# EAGLE design ledui (EAGLE 7.2.0)
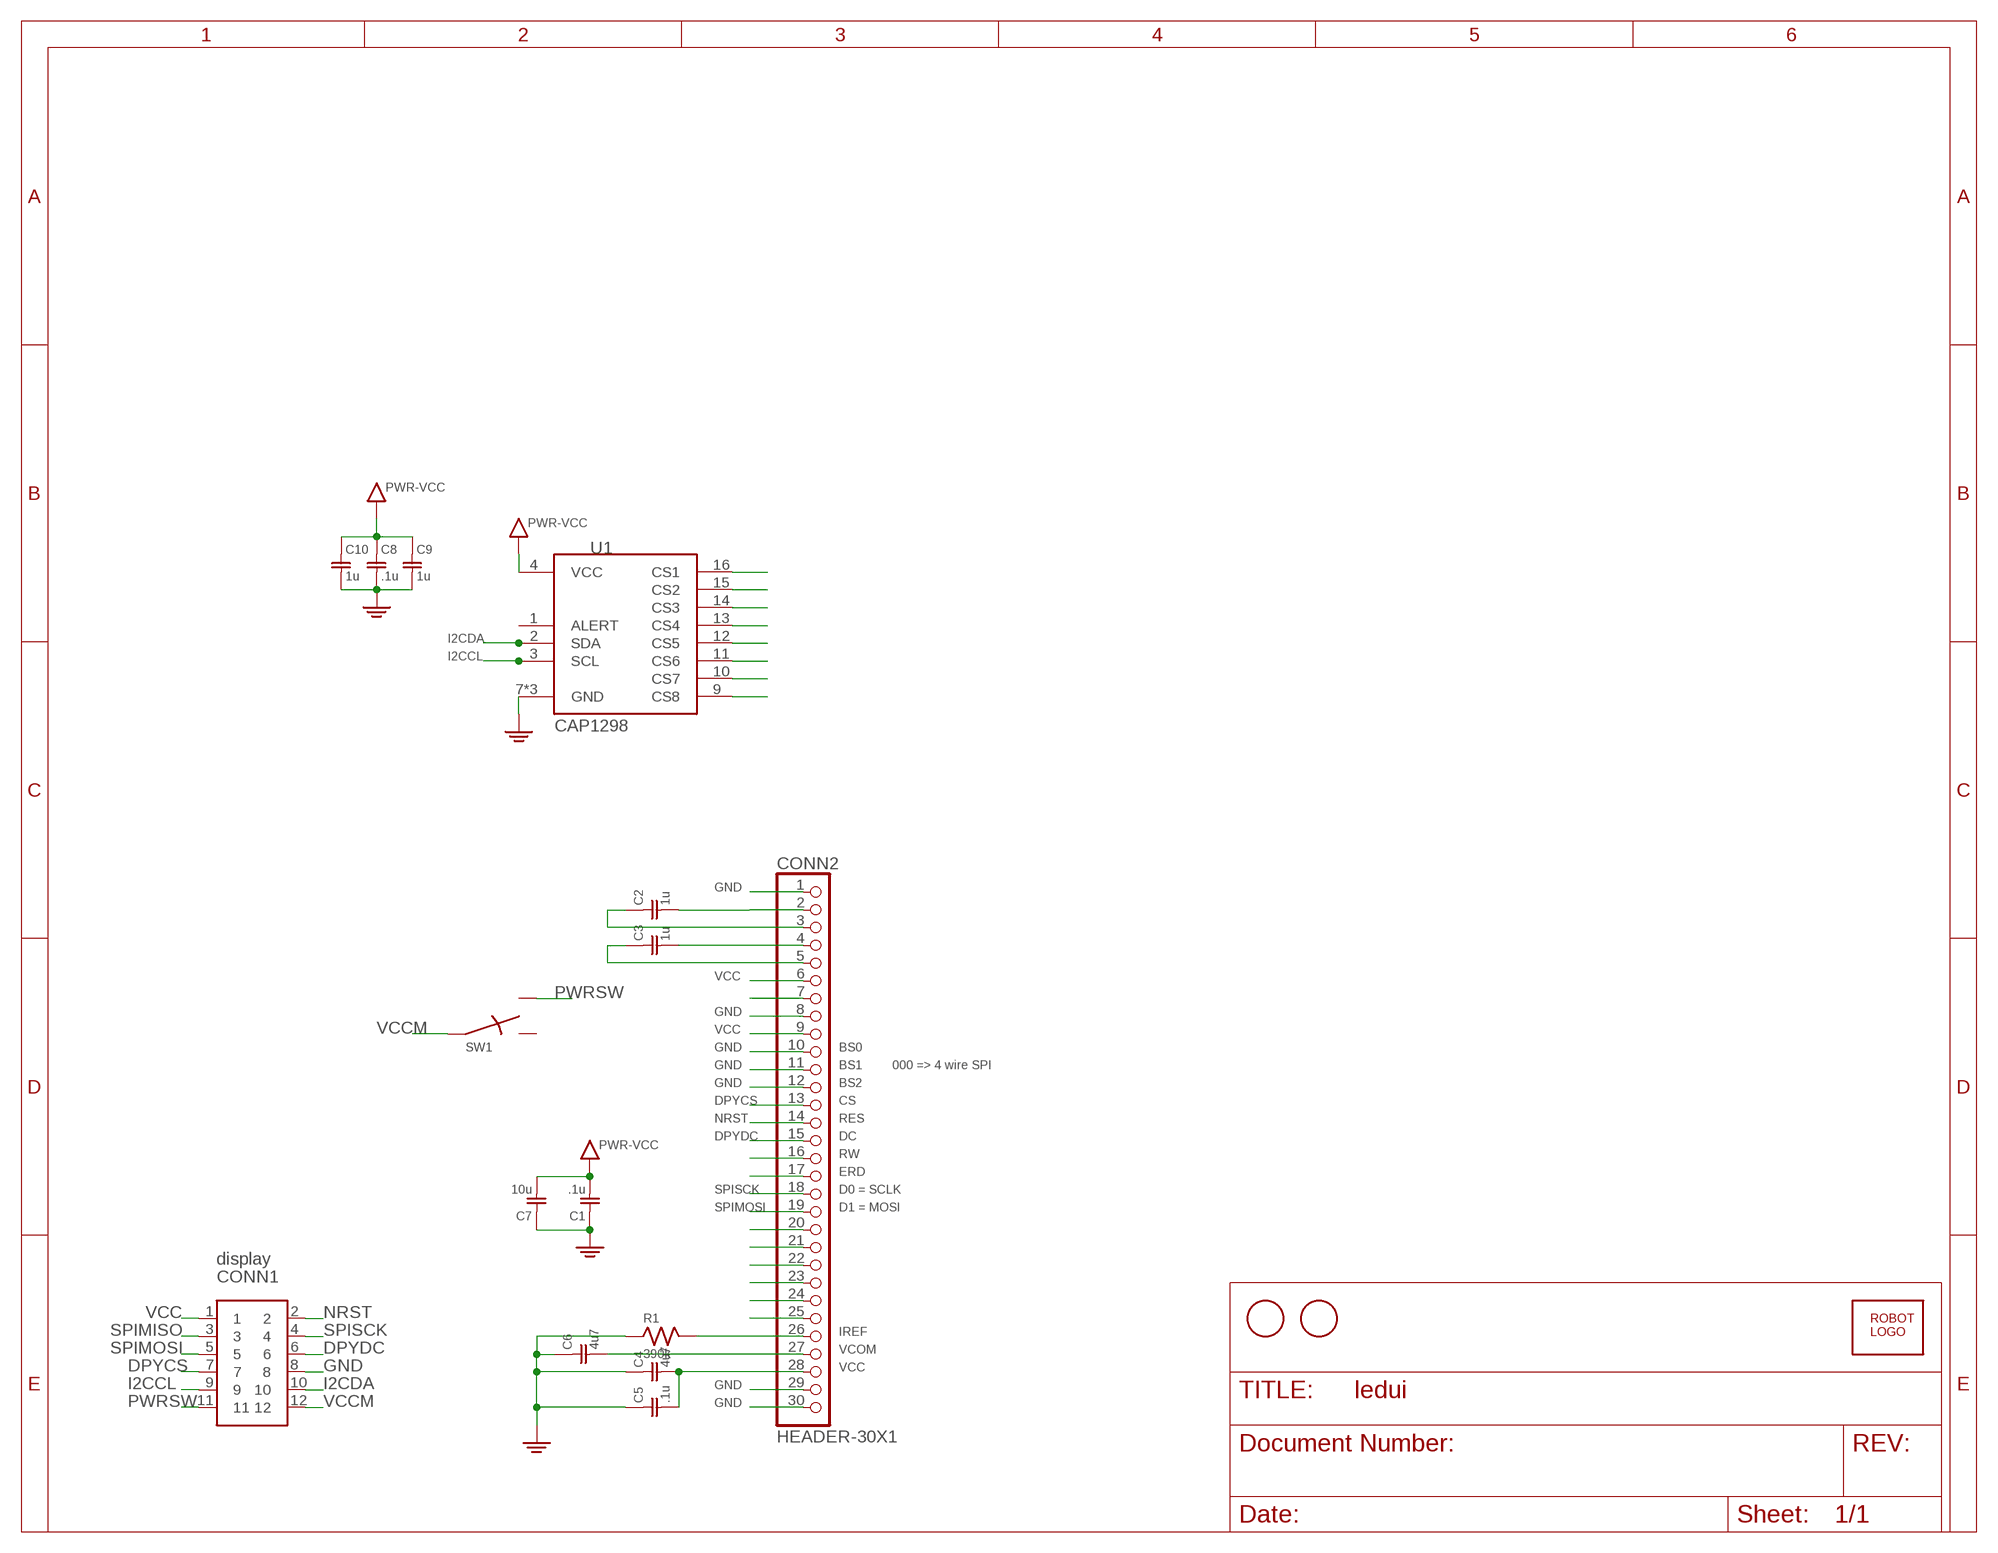
[diagram p0: schematic, sheet 1]

## Parts
C1  .1u  C0603  [SMD0603]
C2  1u  C0603  [SMD0603]
C3  1u  C0603  [SMD0603]
C4  4u7  C0603  [SMD0603]
C5  .1u  C0603  [SMD0603]
C6  4u7  C0603  [SMD0603]
C7  10u  C0603  [SMD0603]
C8  .1u  C0603  [SMD0603]
C9  1u  C0603  [SMD0603]
C10  1u  C0603  [SMD0603]
CONN1  HEADER-6X2-PTH  [HEADER-6X2-PTH]
CONN2  HEADER-30X1  [HEADER-30X1-SMD7]
R1  390k  R0603  [SMD0603]
SW1  SWITCH-SPDT  [ALPS-SSAJ120100]
U1  CAP1298  [QFN16EP]
U$1  FIDUCIAL  [FIDUCIAL_1MM]
U$2  FIDUCIAL  [FIDUCIAL_1MM]
U$3  ROBOTMAN-LOGO  [ROBOTMAN-LOGO]

## Nets
CS1: U1.16(CS1)
CS2: U1.15(CS2)
CS3: U1.14(CS3)
CS4: U1.13(CS4)
CS5: U1.12(CS5)
CS6: U1.11(CS6)
CS7: U1.10(CS7)
CS8: U1.9(CS8)
DPYCS: CONN1.7 CONN2.13
DPYDC: CONN1.6 CONN2.15
GND: C1.1 C4.1 C5.1 C6.1 C7.1 C8.2 C9.2 C10.2 CONN1.8 CONN2.1 CONN2.8 CONN2.10 CONN2.11 CONN2.12 CONN2.29 CONN2.30 R1.1 U1.7(GND) U1.8(GND) U1.P$1(GND) ; supply symbol labelled PWR-GND
I2CCL: CONN1.9 U1.3(SCL)
I2CDA: CONN1.10 U1.2(SDA)
N$1: C3.2 CONN2.4
N$2: CONN2.7
N$4: C2.1 CONN2.3
N$6: C3.1 CONN2.5
N$9: C2.2 CONN2.2
N$17: CONN2.16
N$18: CONN2.17
N$21: CONN2.20
N$22: CONN2.21
N$23: CONN2.22
N$24: CONN2.23
N$25: CONN2.24
N$26: CONN2.25
N$27: CONN2.26 R1.2
N$28: C6.2 CONN2.27
N$29: C4.2 C5.2 CONN2.28
NRST: CONN1.2 CONN2.14
PWRSW: CONN1.11 SW1.2
SPIMISO: CONN1.3
SPIMOSI: CONN1.5 CONN2.19
SPISCK: CONN1.4 CONN2.18
VCC: C1.2 C7.2 C8.1 C9.1 C10.1 CONN1.1 CONN2.6 CONN2.9 U1.4(VCC) ; supply symbol labelled PWR-VCC
VCCM: CONN1.12 SW1.C
Unconnected: SW1.1 U1.1(ALERT)

## Notes on the sheet
- BS0
- BS1 | 000 => 4 wire SPI
- BS2
- CS
- RES
- DC
- RW
- ERD
- D0 = SCLK
- D1 = MOSI
- display
- IREF
- VCOM
- VCC

## Library data of the parts
C1-C10 = jaw:C
CONN1 = jaw:HEADER-6X2
CONN2 = jaw:HEADER-30X1
R1 = jaw:R
SW1 = jaw:SWITCH-SPDT
U1 = jaw:CAP1298
U$1 U$2 = adafruit:FIDUCIAL: For use by pick and place machines to calibrate the vision/machine, 1mm By microbuilder.eu
U$3 = jaw:ROBOTMAN-LOGO

## Board
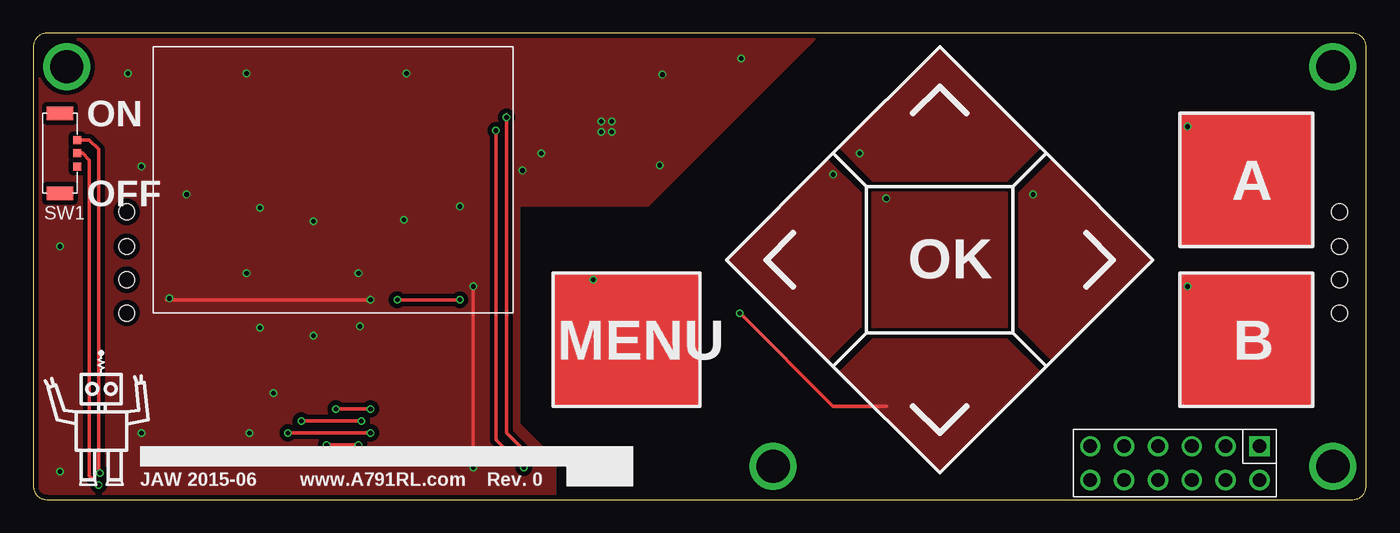
[diagram p1: board, top side]
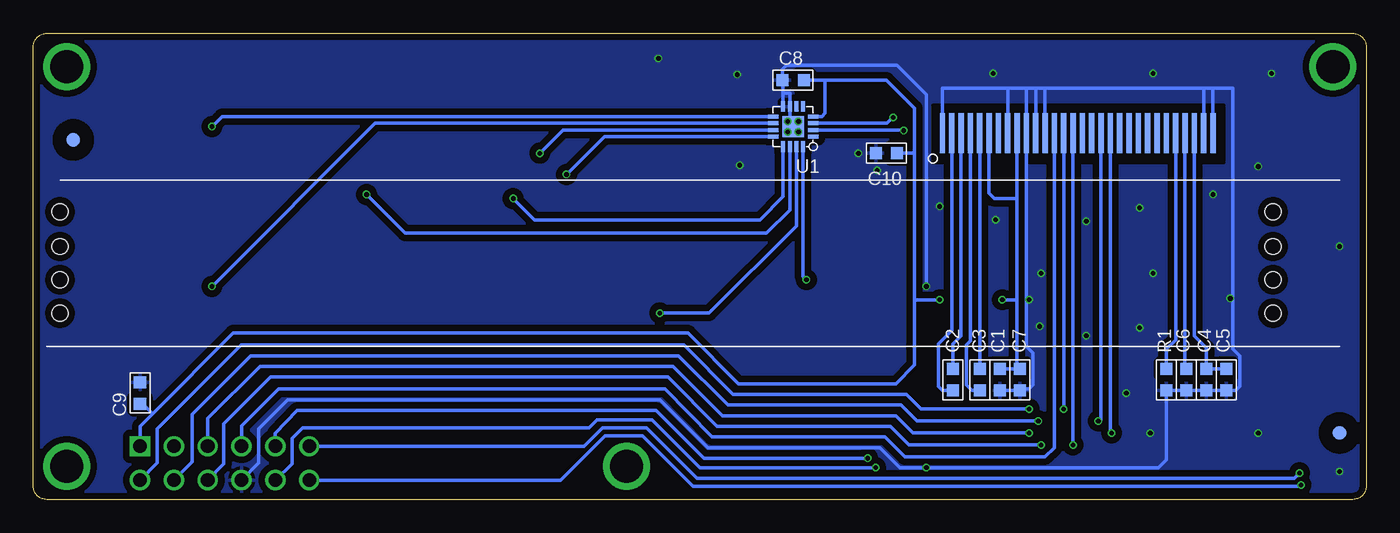
[diagram p2: board, bottom side, seen from below]

Size 100 x 35 mm. Coordinates in mm from the lower left corner, seen from the top.
Outline: 99,35 1,35 arc90 0,34 0,1 arc90 1,0 99,0 arc90 100,1 100,34 arc90 99,35
Copper layers (1*16): Top 0.035559375mm / dielectric 0.17018125mm / Bottom 0.035559375mm
Design rules "OSHPark-4layer *": minimum track width 5mil, minimum drill 10mil, track to track 5mil, track to pad 5mil, pad to pad 5mil, via to via 5mil, smd to smd 5mil, copper to edge 15mil, drill to drill 6mil, minimum pad ring 4mil, minimum via ring 4mil, stop-mask expansion 4mil, vias tented up to drill 0.5mm, thermal gap 10mil
Holes 1.2 mm at 98,21.6 98,19 98,16.5 98,14 7,21.6 7,19 7,16.5 7,14
tKeepout: area -0.4,29.6 to 5.4,35.4; area 94.6,-0.4 to 100.4,5.4; area 52.6,-0.4 to 58.4,5.4; area 94.6,29.6 to 100.4,35.4

### Footprints (pad centres in the part's own frame; a part is rotated, then mirrored left to right if it is on the bottom)
SMD0603 = smd 0.9 x 0.9: 1 -0.8,0; 2 0.8,0
HEADER-6X2-PTH = drill 1.016 square: 1 0,0 | drill 1.016: 2 0,2.54; 3 2.54,0; 4 2.54,2.54; 5 5.08,0; 6 5.08,2.54; 7 7.62,0; 8 7.62,2.54; 9 10.16,0; 10 10.16,2.54; 11 12.7,0; 12 12.7,2.54
HEADER-30X1-SMD7 = smd 0.4 x 3: 1 -9.8,0; 2 -9.1,0; 3 -8.4,0; 4 -7.7,0; 5 -7,0; 6 -6.3,0; 7 -5.6,0; 8 -4.9,0; 9 -4.2,0; 10 -3.5,0; 11 -2.8,0; 12 -2.1,0; 13 -1.4,0; 14 -0.7,0; 15 0,0; 16 0.7,0; 17 1.4,0; 18 2.1,0; 19 2.8,0; 20 3.5,0; 21 4.2,0; 22 4.9,0; 23 5.6,0; 24 6.3,0; 25 7,0; 26 7.7,0; 27 8.4,0; 28 9.1,0; 29 9.8,0; 30 10.5,0
ALPS-SSAJ120100 = smd 0.6 x 0.6: 1 1,1.3; 2 -1,1.3; C 0,1.3 | smd 1 x 2: P$1 -3,0; P$2 3,0
QFN16EP = smd 0.8 x 0.3: 1 -1.5,0.75; 2 -1.5,0.25; 3 -1.5,-0.25; 4 -1.5,-0.75; 9 1.5,-0.75; 10 1.5,-0.25; 11 1.5,0.25; 12 1.5,0.75 | smd 0.3 x 0.8: 5 -0.75,-1.5; 6 -0.25,-1.5; 7 0.25,-1.5; 8 0.75,-1.5; 13 0.75,1.5; 14 0.25,1.5; 15 -0.25,1.5; 16 -0.75,1.5 | smd 1.6 x 1.6: P$1 0,0
FIDUCIAL_1MM = smd 1 x 1: 1 0,0

### Placement (x,y rotation side)
C1  27.5,9 90 bottom
C2  31,9 270 bottom
C3  29,9 270 bottom
C4  12,9 90 bottom
C5  10.5,9 90 bottom
C6  13.5,9 90 bottom
C7  26,9 90 bottom
C8  43,31.5 180 bottom
C9  92,8 90 bottom
C10  36,26 180 bottom
CONN1  92,4 180 top
CONN2  22,27.5 0 bottom
R1  15,9 90 bottom
SW1  2,26 270 top
U1  43,28 180 bottom
U$1  97,27 0 bottom
U$2  2,5 0 bottom
U$3  5.1,5.4 0 top

### Tracks (layer width: path | path; a pad name or v marks a point on that pad's centre or on a via)
CS1  (via drill 0.35)
  Bottom 0.25: U1.16 42.25,16.75 v42,16.5
CS2  (via drill 0.35)
  Top 0.25: v53,14 60,7 64,7
  Bottom 0.25: U1.15 42.75,20.55 49.3,14 v53,14
  pour Top: 68,2 75.5,9.5 73,12 63,12 60.5,9.5
CS3  (via drill 0.35)
  Bottom 0.25: U1.14 43.25,21.75 45,20 72.1,20 v75,22.9
  pour Top: 84,18 76.5,25.5 74,23 74,13 76.5,10.5
CS4  (via drill 0.35)
  Bottom 0.25: U1.13 43.75,22.75 45.5,21 62.4,21 v64,22.6
  pour Top: 73,18 73,13 63,13 63,23 73,23
CS5  (via drill 0.35)
  Bottom 0.25: U1.12 57.15,27.25 v60,24.4
  pour Top: 52,18 59.5,25.5 62,23 62,13 59.5,10.5
CS6  (via drill 0.35)
  Bottom 0.25: U1.11 60.25,27.75 v62,26
  pour Top: 68,34 75.5,26.5 73,24 63,24 60.5,26.5
CS7  (via drill 0.35)
  Bottom 0.25: U1.10 74.35,28.25 v86.6,16
CS8  (via drill 0.35)
  Bottom 0.25: U1.9 85.85,28.75 v86.6,28
DPYCS
  Bottom 0.25: CONN2.13 23.4,3.9 24.1,3.2 34.6,3.2 36.1,4.7 49.1,4.7 52.6,8.3 81.6,8.3 84.38,5.52 CONN1.7
DPYDC  (via drill 0.35)
  Top 0.25: v24.4,4.1 v22,4.1
  Bottom 0.25: CONN2.15 v22,4.1 | CONN1.6 85.7,2.68 85.7,5.7 82.2,9.2 52.4,9.2 48.7,5.5 35.7,5.5 34.3,4.1 v24.4,4.1
GND  (via drill 0.35)
  Top 0.25: 10,15 10.2,15 v25.3,15 | v33,16 v33,2.4
  Bottom 0.25: C1.1 C7.1 25.9,8.3 25.3,8.3 25,8.6 25,11 25.5,11.5 CONN2.10 25.5,30.9 | CONN2.8 26.9,30.9 | CONN2.1 31.8,30.9 26.9,30.9 | CONN2.11 24.8,30.9 | CONN2.12 24.1,30.9 | CONN2.30 11.5,30.9 | CONN2.29 12.2,30.9 | R1.1 C6.1 C4.1 C5.1 9.8,8.2 9.5,8.5 9.5,10.8 10,11.3 10,30.9 24.1,30.9 | R1.1 13.3,8.2 | 24.1,30.9 24.8,30.9 | 24.8,30.9 25.5,30.9 | 25.5,30.9 26.9,30.9 | CONN1.8 83.1,2.74 83.1,5.3 80.9,7.5 53,7.5 49.4,3.9 36.5,3.9 35,2.4 v33,2.4 15.6,2.4 15,3 R1.1 | U1.8 43.75,30.5 | 43.75,30.5 43.75,31.45 C8.2 43.8,32.3 43.5,32.6 35.2,32.6 33,30.4 v33,16 | 43.75,30.5 43.25,30.5 U1.7 43.25,28.25 U1.P$1
  other vias: 10.2,15.1 2,2.1 2,19 7.1,32 8.1,5 16.2,5 16,32 28,32 53.1,33.1 47,25.1 38.1,26 27.8,21 17,21.9 17,12.9 8.1,25 47.2,31.9 36.7,24.7 42.6,28.4 43.4,28.4 43.4,27.6 42.6,27.6 11.5,22.9 16,17 21,20.9 24.4,17 32,22 21,12.3 24.5,13 18,8
  pour Bottom (isolate 0.5): 0,0 0,35 100,35 100,0
  pour Top (isolate 0.35): 0,0 0,35 59,35 46.1,22.1 36.4,22.1 36.4,5.7 39.1,3 39.1,0
I2CCL  (via drill 0.35)
  Top 0.25: v37.4,3.1 35.5,5 v35.5,28.7 | v35.5,28.7 35.5,28.9 v35.5,28.7
  Bottom 0.25: CONN1.9 81.84,4.96 80.2,6.7 53.3,6.7 49.7,3.1 v37.4,3.1 | U1.3 35.95,28.25 v35.5,28.7
I2CDA  (via drill 0.35)
  Top 0.25: v36.8,2.4 34.7,4.5 v34.7,27.7 | v34.7,27.7 34.7,27.8 v34.7,27.7
  Bottom 0.25: CONN1.10 80.6,2.7 80.6,4.6 79.8,5.4 58.3,5.4 57.7,6 53.6,6 50,2.4 v36.8,2.4 | U1.2 34.75,27.75 v34.7,27.7
N$1
  Bottom 0.25: CONN2.4 29.7,11.9 30,11.6 30,8.6 29.6,8.2 C3.2
N$3  (via drill 2.5)
  other vias: 97.5,2.5
N$4
  Bottom 0.25: CONN2.3 30.4,12.3 31,11.7 C2.1
N$5  (via drill 2.5)
  other vias: 2.5,32.5
N$6
  Bottom 0.25: CONN2.5 C3.1
N$7  (via drill 2.5)
  other vias: 97.5,32.5
N$8  (via drill 2.5)
  other vias: 55.5,2.5
N$9
  Bottom 0.25: CONN2.2 31.1,12.7 32.1,11.7 32.1,8.5 31.8,8.2 C2.2
N$10
  cutout Bottom: 10.7,29.6 32.5,29.6 32.5,25.3 10.7,25.3
N$27
  Bottom 0.25: CONN2.26 14.3,12 15,11.3 R1.2
N$28
  Bottom 0.25: CONN2.27 13.6,9.9 C6.2
N$29
  Bottom 0.25: CONN2.28 12.9,12.3 12,11.4 C4.2 C5.2
NRST  (via drill 0.35)
  Top 0.25: v25.3,6.8 v22.7,6.8
  Bottom 0.25: CONN2.14 v22.7,6.8 | CONN1.2 90.7,2.76 90.7,5.3 84.4,11.6 51.2,11.6 47.5,7.9 34.5,7.9 33.4,6.8 v25.3,6.8
PWRSW  (via drill 0.35)
  Top 0.25: v5,2 4.9,2.1 4.9,26.3 4.2,27 SW1.2
  Bottom 0.25: CONN1.11 58.7,4 57.3,5.4 54,5.4 50.2,1.6 5.4,1.6 v5,2
SPIMOSI  (via drill 0.35)
  Top 0.25: v19.1,5 v25.3,5
  Bottom 0.25: CONN1.5 86.92,6.08 83,10 52,10 48.3,6.3 35.3,6.3 34,5 v25.3,5 | CONN2.19 19.2,5.1 v19.1,5
SPISCK  (via drill 0.35)
  Top 0.25: v24.6,5.9 v20.1,5.9
  Bottom 0.25: CONN2.18 19.9,6 v20.1,5.9 | CONN1.4 88.1,2.82 88.1,6.4 83.7,10.8 51.6,10.8 47.9,7.1 34.9,7.1 33.7,5.9 v24.6,5.9
VCC  (via drill 0.35)
  Top 0.25: v32,15 v27.3,15
  Bottom 0.25: CONN2.9 26.2,22.6 | 26.2,22.6 26.2,15 | 26.2,15 26.2,10 C7.2 C1.2 | CONN1.1 92,5.5 91.05,6.45 | v27.3,15 26.2,15 | 91.05,6.45 85,12.5 50.9,12.5 47.1,8.7 35.3,8.7 33.9,10.1 33.9,15 | U1.4 40.85,28.75 40.6,29 40.6,31.5 | C8.1 40.6,31.5 | 40.6,31.5 36,31.5 33.9,29.4 33.9,26 | 33.9,15 33.9,26 | v32,15 33.9,15 | C9.1 91.8,7.2 91.05,6.45 | C10.1 33.9,26 | CONN2.6 28.3,23 27.9,22.6 26.2,22.6
VCCM  (via drill 0.35)
  Top 0.25: v4.9,1.1 4.2,1.8 4.2,25.5 3.7,26 SW1.C
  Bottom 0.25: CONN1.12 60.44,1.46 57.1,4.8 54.3,4.8 50.5,1 5,1 v4.9,1.1
(copper drawn outside any net)
  shapes: Top area x3

### Text on the board
tPlace: ON | OFF | A | OK | MENU | B | JAW 2015-06 | www.A791RL.com | Rev. 0